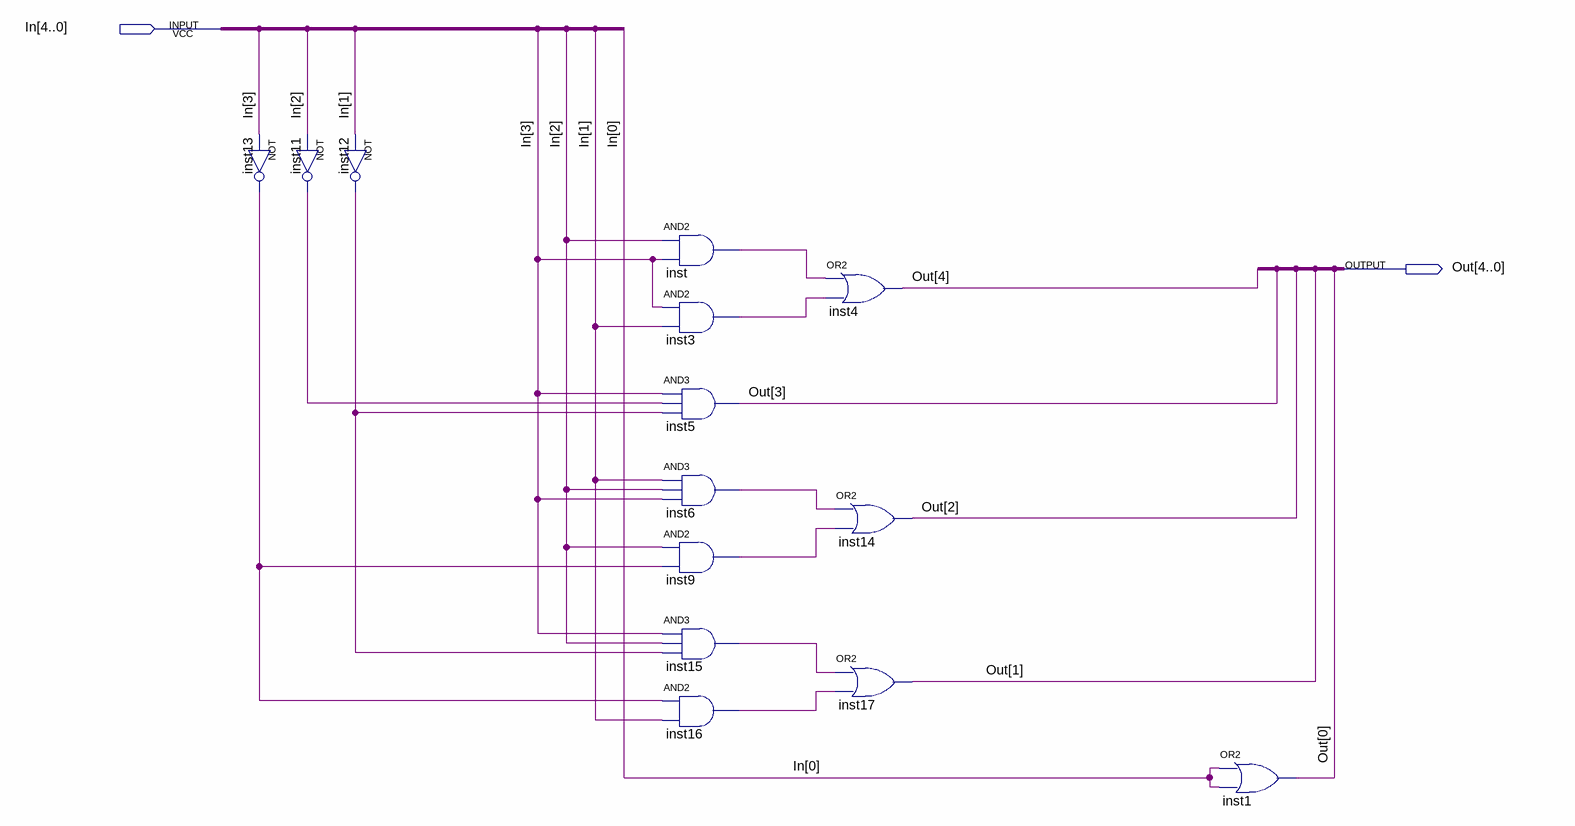
[diagram p0: schematic sheet]
// Quartus schematic input_binary_bcd.bdf as structural Verilog: 14 symbols, 2 pins
module input_binary_bcd (
  input  [4:0] In,
  output [4:0] Out
);

  wire inst3_out, inst6_out, inst9_out, inst11_out, inst12_out, inst13_out, inst15_out, inst16_out, inst_out;

  not inst13 (inst13_out, In[3]);
  not inst11 (inst11_out, In[2]);
  not inst12 (inst12_out, In[1]);
  and inst (inst_out, In[2], In[3]);
  and inst3 (inst3_out, In[3], In[1]);
  and inst5 (Out[3], In[3], inst11_out, inst12_out);
  and inst6 (inst6_out, In[1], In[2], In[3]);
  and inst9 (inst9_out, In[2], inst13_out);
  and inst15 (inst15_out, In[3], In[2], inst12_out);
  and inst16 (inst16_out, inst13_out, In[1]);
  or inst4 (Out[4], inst_out, inst3_out);
  or inst14 (Out[2], inst6_out, inst9_out);
  or inst17 (Out[1], inst15_out, inst16_out);
  or inst1 (Out[0], In[0], In[0]);
endmodule
